# Altium schematic sheet 51-2001-01-11_04 Power Module Schematic.SchDoc
size 431 x 279 mm; Organization: ORGANIZATION; Address1: ADDRESS 1; Address2: ADDRESS 2; Address3: ADDRESS 3; Address4: ADDRESS 4; Revision: -; SheetNumber: 4; SheetTotal: 4; ENG_APP_DATE: --/--/--; DSN_APP_DATE: --/--/--; CHK_APP_DATE: --/--/--
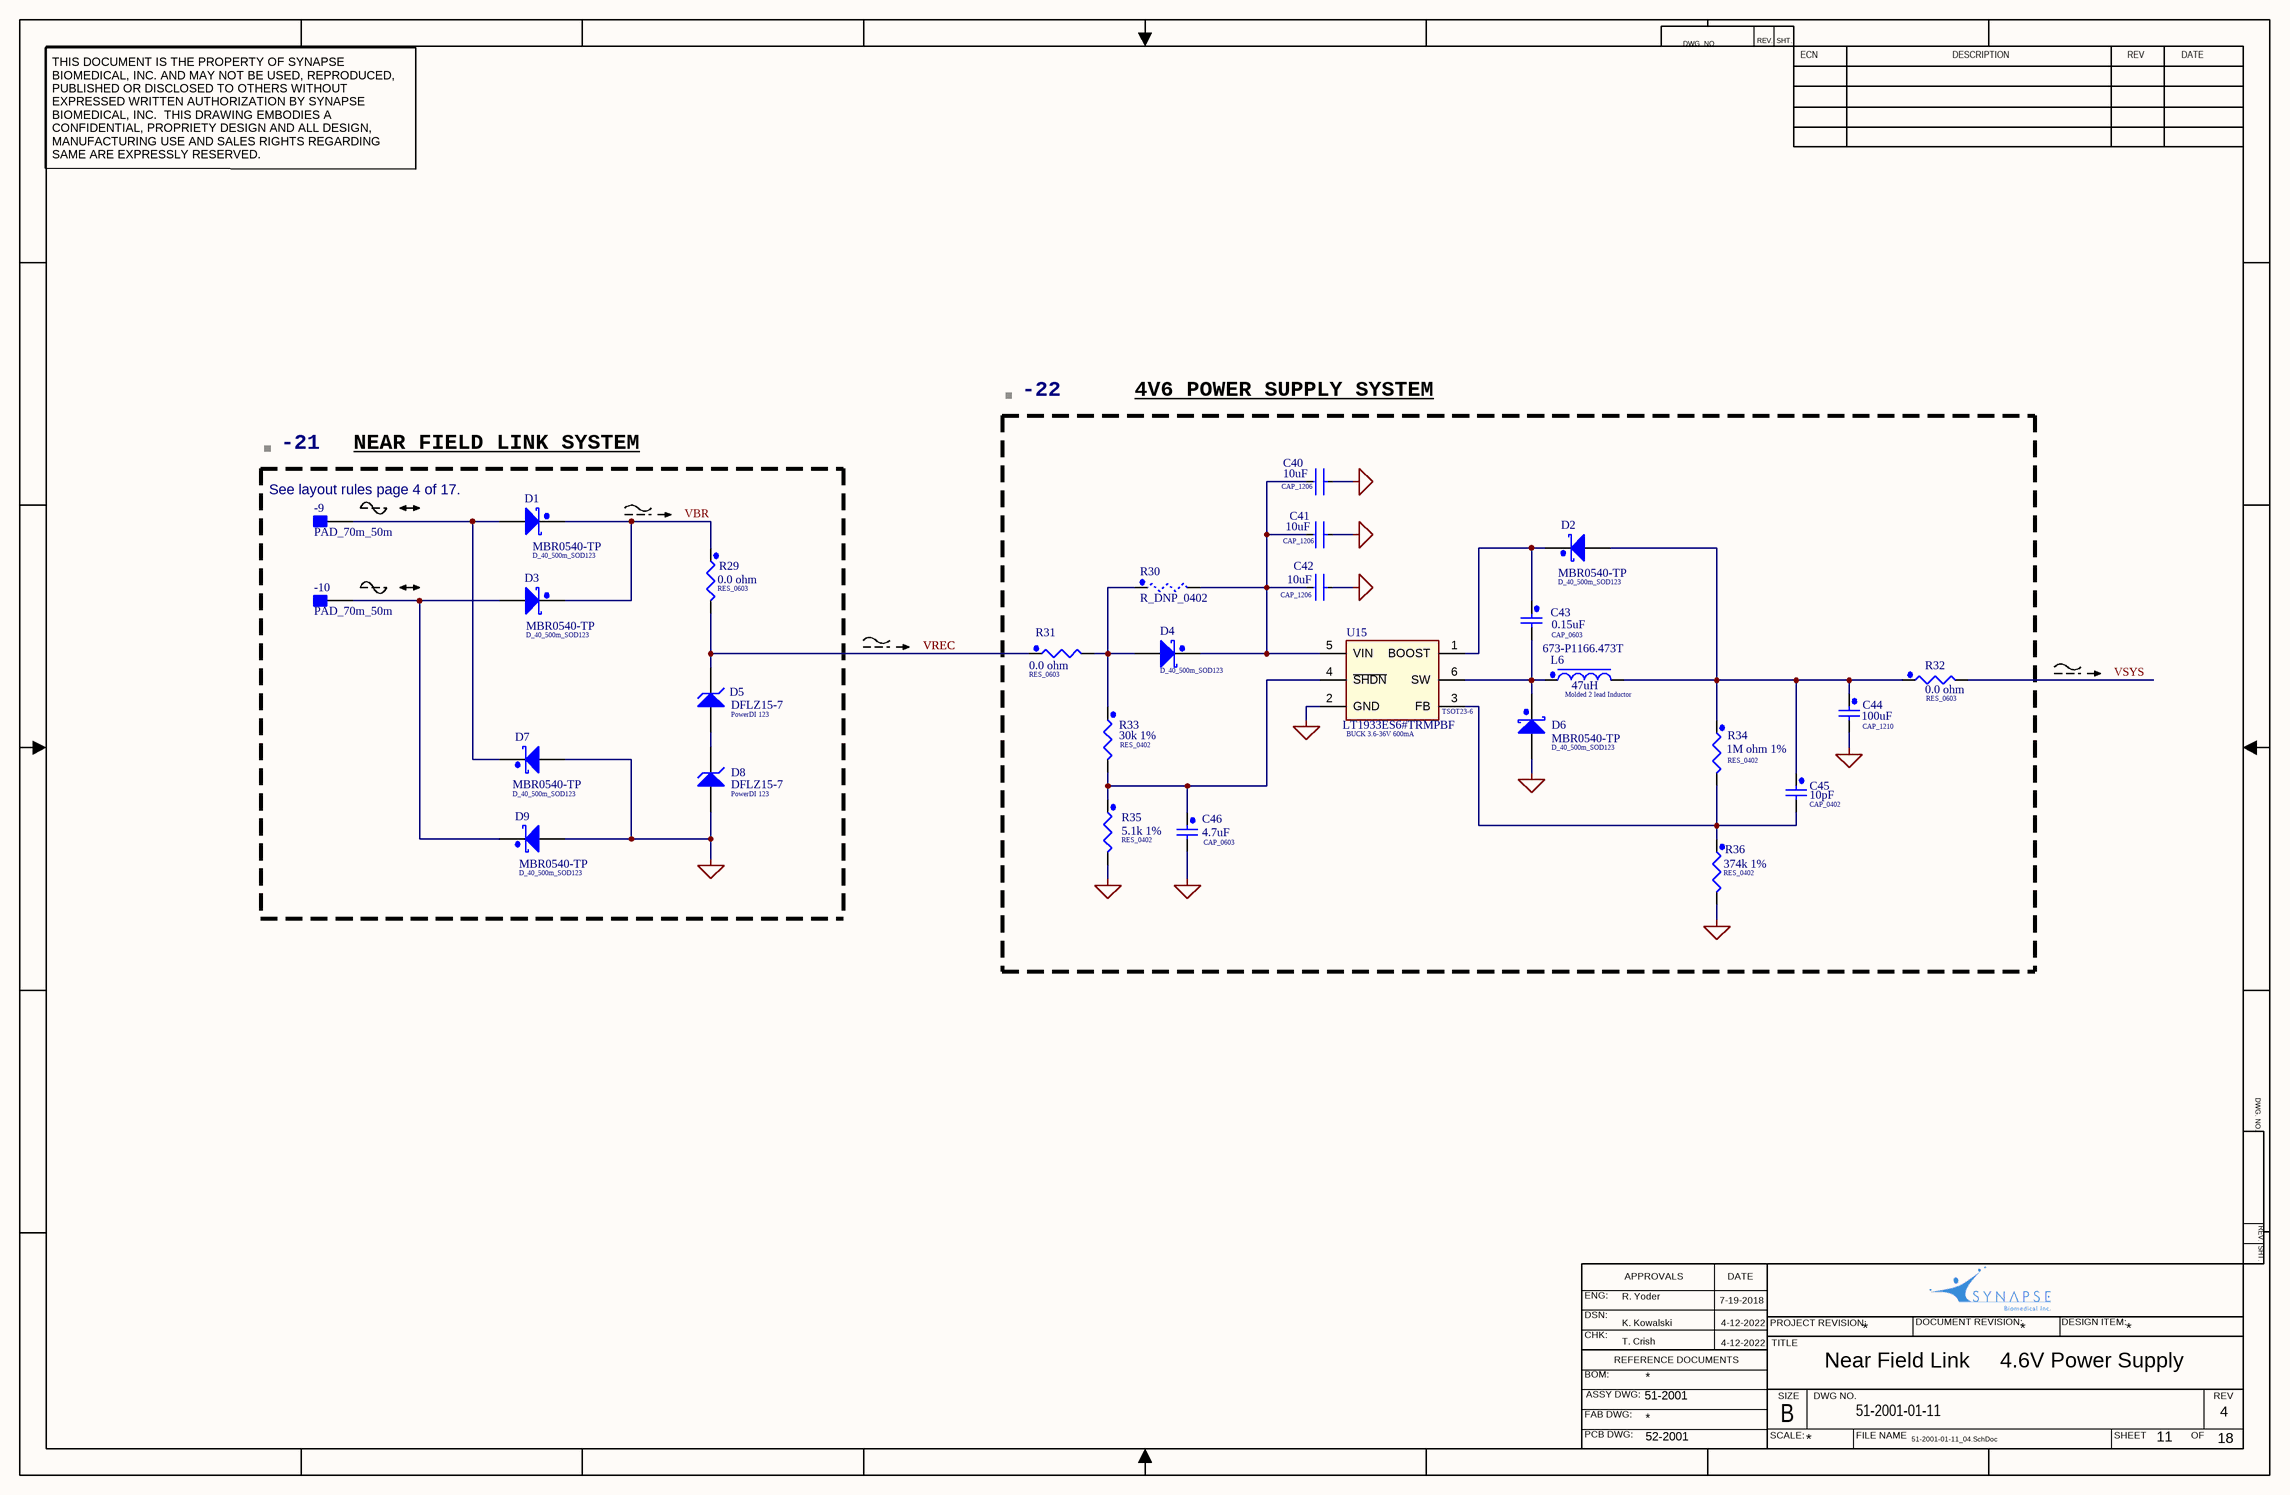
[diagram p0: 51-2001-01-11_04 Power Module Schematic.SchDoc]

## Parts
-9  PAD_70m_50m  [PAD_70m_50m]  (no BOM)
-10  PAD_70m_50m  [PAD_70m_50m]  (no BOM)
-21  XDESCRIPTION: NEAR FIELD LINK SYSTEM  (hidden comment: BOM_S1)  (graphical)
-22  XDESCRIPTION: 4V6 POWER SUPPLY SYSTEM  (hidden comment: BOM_S1)  (graphical)
C40  10uF  Case/Package: CAP_1206  [FP-GRT31C-0_2-IPC_A]
C41  10uF  Case/Package: CAP_1206  [FP-GRT31C-0_2-IPC_A]
C42  10uF  Case/Package: CAP_1206  [FP-GRT31C-0_2-IPC_A]
C43  value 0.15uF  [CAP_0603]  (hidden comment: C_150n_X7R_16_0603_10%)
C44  value 100uF  [CAP_1210]  (hidden comment: C_100u_X5R_10_1210_20%)
C45  value 10pF  [CAP_0402]  (hidden comment: C_10p_C0G_50_0402_5%)
C46  value 4.7uF  [CAP_0603]  (hidden comment: C_4u7_X5R_10_0603_10%)
D1  D_40_500m_SOD123  [SOD123]
D2  D_40_500m_SOD123  [SOD123]
D3  D_40_500m_SOD123  [SOD123]
D4  D_40_500m_SOD123  [SOD123]
D5  PackageDescription: PowerDI 123  [POWERDI]  (hidden comment: Zener Diode, 15V, 1W, DI123, RoHS)
D6  D_40_500m_SOD123  [SOD123]
D7  D_40_500m_SOD123  [SOD123]
D8  PackageDescription: PowerDI 123  [POWERDI]  (hidden comment: Zener Diode, 15V, 1W, DI123, RoHS)
D9  D_40_500m_SOD123  [SOD123]
L6  value 47uH  PackageDescription: Molded 2 lead Inductor  Supplier Part Number 1: 673-P1166.473T  [IND-P1166NL]  (hidden comment: 47uF_830m_3030_20%)
R29  value 0.0 ohm  [RES_0603]  (hidden comment: R_0_0603)
R30  R_DNP_0402  [RES_0402]  (no BOM)
R31  value 0.0 ohm  [RES_0603]  (hidden comment: R_0_0603)
R32  value 0.0 ohm  [RES_0603]  (hidden comment: R_0_0603)
R33  value 30k 1%  [RES_0402]  (hidden comment: R_30k_0402)
R34  value 1M ohm 1%  [RES_0402]  (hidden comment: RES_0402)
R35  value 5.1k 1%  [RES_0402]  (hidden comment: R_5k1_0402)
R36  value 374k 1%  [RES_0402]  (hidden comment: R_374k_0402)
U15  BUCK 3.6-36V 600mA  PackageDescription: TSOT23-6  MPN: LT1933ES6#TRMPBF  [SOT23-6]

## Blocks framed on the sheet
See layout rules page 4 of 17.: -9 -10 D1 D3 D5 D7-D9 R29

## Nets
GND: C40.1 C41.1 C42.1 C44.2 C46.2 D6.2(A) D7.2(A) D8.2(A) D9.2(A) R35.2 R36.2 U15.2(GND)
VBR: D1.1(C) D3.1(C) R29.1
VREC: D5.1(C) R29.2 R31.1
VSYS: R32.2
Net-9_1: -9.1 D1.2(A) D7.1(C)
Net-10_1: -10.1 D3.2(A) D9.1(C)
NetC40_2: C40.2 C41.2 C42.2 D4.1(C) R30.2 U15.5(VIN)
NetC43_1: C43.1 D2.1(C) U15.1(BOOST)
NetC43_2: C43.2 D6.1(C) L6.1 U15.6(SW)
NetC44_1: C44.1 C45.1 D2.2(A) L6.2 R32.1 R34.1
NetC45_2: C45.2 R34.2 R36.1 U15.3(FB)
NetC46_1: C46.1 R33.2 R35.1 U15.4(~{SHDN})
NetD4_2: D4.2(A) R30.1 R31.2 R33.1
NetD5_2: D5.2(A) D8.1(C)

## Notes on the sheet
- DWG. NO.
- REV.
- SHT.
- ECN
- DESCRIPTION
- REV
- DATE
- THIS DOCUMENT IS THE PROPERTY OF SYNAPSE BIOMEDICAL, INC. AND MAY NOT BE USED, REPRODUCED, PUBLISHED OR DISCLOSED TO OTHERS WITHOUT EXPRESSED WRITTEN AUTHORIZATION BY SYNAPSE BIOMEDICAL, INC.  THIS DRAWING EMBODIES A CONFIDENTIAL, PROPRIETY DESIGN AND ALL DESIGN, MANUFACTURING USE AND SALES RIGHTS REGARDING SAME ARE EXPRESSLY RESERVED.
- ENG:
- R. Yoder
- APPROVALS
- 7-19-2018
- DSN:
- CHK:
- REFERENCE DOCUMENTS
- K. Kowalski
- T. Crish
- 4-12-2022
- PROJECT REVISION:
- TITLE
- Near Field Link     4.6V Power Supply
- *
- DOCUMENT REVISION:
- DESIGN ITEM:
- BOM:
- FAB DWG:
- PCB DWG:
- ASSY DWG:
- 51-2001
- SCALE:
- SIZE
- B
- DWG NO.
- 51-2001-01-11
- FILE NAME
- SHEET
- OF
- 4
- 52-2001
- 51-2001-01-11_04.SchDoc
- 11
- 18

## Library data of the parts
-9 -10 = PAD_70m_50m: SMT pad rectangular; PackageDescription: SMT pad
-21 -22 = BOM_S1: BOM item small graphic
C40-C42 = CMP-06035-000076-2: Multi-Layer Ceramic Capacitor 10uF 50V X5R ±10% 1206 Emboss T/R / GRT31CR61H106KE01L; Manufacture 1: Murata Electronics; Length: 0.126inch; Max Operating Temperature: 85°C; Width: 0.063inch; Ratings: AEC-Q200; Voltage Rating: 50V; Dielectric: X5R; Min Operating Temperature: -55°C; Case Code (Imperial): 1206; Capacitance: 10uF; Case Code (Metric): 3216; Thickness: 0.071inch; Tolerance: 10%; Mount: Surface Mount; Packaging: Cut Tape; Voltage Rating (DC): 50V
C43 = GRM188R71C154KA01D: 0.15uF, 16V, X7R, 10%, 0603, RoHS; MFR: Murata Electronics North America; SBI: 53-0070; PackageDescription: CAP_0603; Supplier 1: Digi-Key; Supplier Part Number 1: 490-3292-1-ND; MPN: GRM188R71C154KA01D
C44 = LMK325BJ107MM-T: 100uF, 10V, X5R, 20%, 1210, RoHS; MFR: Murata Electronics North America; MPN: GRM32ER61A107ME20L; SBI: 53-0080; PackageDescription: CAP_1210; Supplier 1: Digi-Key; Supplier Part Number 1: 490-9969-6-ND
C45 = GRM1555C1H100JZ01: 10pF, 50V, C0G, 5%, 0402, RoHS; MFR: Murata Electronics North America; MPN: GRM1555C1H100JA01D; SBI: 53-0041-7; PackageDescription: CAP_0402; Supplier 1: Digi-Key; Supplier Part Number 1: 490-5921-6-ND
C46 = LMK107BJ475KA-T: 4.7uF, 10V, X5R, 10%, 0603, RoHS; MFR: Murata Electronics North America; MPN: GRM185R61A475KE11D; SBI: 53-0076; PackageDescription: CAP_0603; Supplier 1: Digi-Key; Supplier Part Number 1: 490-11988-6-ND
D1-D4 D6 D7 D9 = MBR0540-TP: Schotty Diode, 40V, 500mA, SOD123, RoHS; MFR: Micro Commercial Co.; SBI: 54-0084; PackageDescription: SOD123; Supplier 1: Digi-Key; Supplier Part Number 1: MBR0540TPMSCT-ND; Value: 500mA; MPN: MBR0540-TP
D5 D8 = DFLZ15-7: MFR: Diodes Inc.; SBI: 54-0111; Supplier 1: Digi-Key; Supplier Part Number 1: DFLZ15DICT-ND; MPN: DFLZ15-7; MPN2: DFLZ15Q-7; MFR2: Diodes Inc.
  D5: Value: DFLZ15-7
  D8: Value: 15V
L6 = P1166.473T: 47uH, 830mA, 20%, RoHS; MFR: Pulse; MPN: P1166.473NLT; SBI: 53-0090; Supplier 1: Mouser
R29 R31 R32 = MCR03ERTJ000: 0.0 ohm, 1/16W, 0603, RoHS; MFR: Vishay Dale; MPN: CRCW06030000Z0EA; SBI: 53-0075; PackageDescription: RES_0603; Supplier 1: Digi-Key; Supplier Part Number 1: 541-1.00KLDKR-ND
R30 = R_DNP_0402: DO NOT POPULATE; MFR: DO NOT POPULATE; MPN: DO NOT POPULATE; PackageDescription: 0402
R33 = MCR01MZPF3002: 30k ohm, 1%, 1/16W, 0402, RoHS; MFR: Vishay Dale; MPN: CRCW040230K0FKED; SBI: 53-0049-21; PackageDescription: RES_0402; Supplier 1: Digi-Key; Supplier Part Number 1: 541-30.0KLDKR-ND
R34 = MCR01MZPF1004: 1M ohm, 1/16W, 1%, 0402, RoHS; MFR: Vishay Dale; MPN: CRCW04021M00FKED; SBI: 53-0095; PackageDescription: RES_0402; Supplier 1: Digi-Key; Supplier Part Number 1: 541-1.00MLDKR-ND
R35 = MCR01MZPF5101: 5.1K ohm, 1%, 1/16W, smd, 0402, RoHS; MFR: Vishay Dale; MPN: CRCW04025K10FKED; SBI: 53-0049-24; PackageDescription: RES_0402; Supplier 1: Digi-Key; Supplier Part Number 1: 541-5.10KLDKR-ND
R36 = CRCW0402374KFKED: 374k ohm, 1%, 1/16W, 0402,RoHS; MFR: Vishay Dale; SBI: 53-0049-25; PackageDescription: RES_0402; Supplier 1: Digi-Key; Supplier Part Number 1: 541-374KLDKR-ND; MPN: CRCW0402374KFKED
U15 = LT1933ES6: DC buck, 3.6-36V, 600mA, TSOT23-6, RoHS; MFR: Linear Technology; SBI: 54-0096; Supplier Part Number 1: LT1933ES6#TRMPBFDKR-ND; Supplier 1: Digi-Key